# Altium schematic sheet Sensor Interface.SchDoc
size A4; SheetNumber: 3; SheetTotal: 4
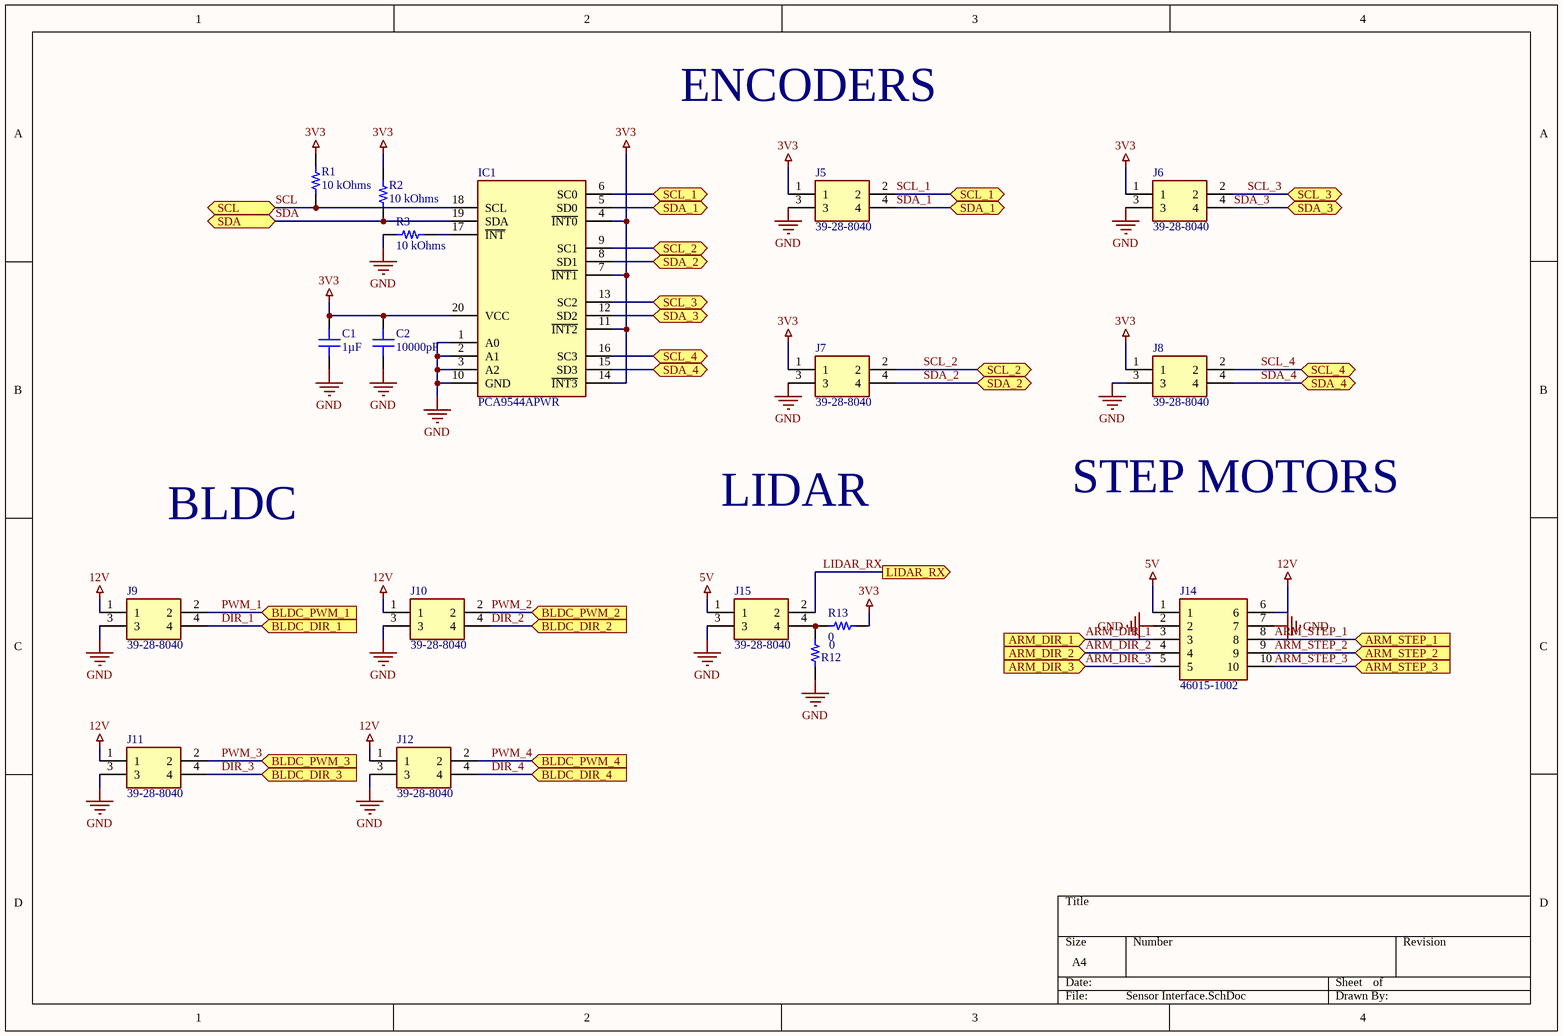
[diagram p0: Sensor Interface.SchDoc]

## Parts
C1  1µF  [CAP 0603_1608]
C2  10000pF  [CAP 0603_1608]
IC1  PCA9544APWR  [SOP65P640X120-20N]
J5  39-28-8040  [RHDR4W125P550X420_2X2_960X960X1310P]
J6  39-28-8040  [RHDR4W125P550X420_2X2_960X960X1310P]
J7  39-28-8040  [RHDR4W125P550X420_2X2_960X960X1310P]
J8  39-28-8040  [RHDR4W125P550X420_2X2_960X960X1310P]
J9  39-28-8040  [RHDR4W125P550X420_2X2_960X960X1310P]
J10  39-28-8040  [RHDR4W125P550X420_2X2_960X960X1310P]
J11  39-28-8040  [RHDR4W125P550X420_2X2_960X960X1310P]
J12  39-28-8040  [RHDR4W125P550X420_2X2_960X960X1310P]
J14  46015-1002  [460151002]
J15  39-28-8040  [RHDR4W125P550X420_2X2_960X960X1310P]
R1  10 kOhms  [RES 0603_1608]
R2  10 kOhms  [RES 0603_1608]
R3  10 kOhms  [RES 0603_1608]
R12  0  [RES 0603_1608]
R13  0  [RES 0603_1608]

## Ports
ARM_DIR_1 (in), ARM_DIR_2 (in), ARM_DIR_3 (in), ARM_STEP_1 (in), ARM_STEP_2 (in), ARM_STEP_3 (in), BLDC_DIR_1 (in), BLDC_DIR_2 (in), BLDC_DIR_3 (in), BLDC_DIR_4 (in), BLDC_PWM_1 (in), BLDC_PWM_2 (in), BLDC_PWM_3 (in), BLDC_PWM_4 (in), LIDAR_RX (out), SCL (bidir), SCL_1 (bidir), SCL_2 (bidir), SCL_3 (bidir), SCL_4 (bidir), SDA (bidir), SDA_1 (bidir), SDA_2 (bidir), SDA_3 (bidir), SDA_4 (bidir)

## Nets
3V3: C1.2 C2.2 IC1.4(~{INT0}) IC1.7(~{INT1}) IC1.11(~{INT2}) IC1.14(~{INT3}) IC1.20(VCC) J5.1 J6.1 J7.1 J8.1 R1.2 R2.2 R13.2
5V: J14.1 J15.1
12V: J9.1 J10.1 J11.1 J12.1 J14.6
GND: C1.1 C2.1 IC1.1(A0) IC1.2(A1) IC1.3(A2) IC1.10(GND) J5.3 J6.3 J7.3 J8.3 J9.3 J10.3 J11.3 J12.3 J14.2 J14.7 J15.3 R3.1 R12.1
ARM_DIR_1: J14.3 ; port ARM_DIR_1
ARM_DIR_2: J14.4 ; port ARM_DIR_2
ARM_DIR_3: J14.5 ; port ARM_DIR_3
ARM_STEP_1: J14.8 ; port ARM_STEP_1
ARM_STEP_2: J14.9 ; port ARM_STEP_2
ARM_STEP_3: J14.10 ; port ARM_STEP_3
DIR_1: J9.4 ; port BLDC_DIR_1
DIR_2: J10.4 ; port BLDC_DIR_2
DIR_3: J11.4 ; port BLDC_DIR_3
DIR_4: J12.4 ; port BLDC_DIR_4
LIDAR_RX: J15.2 ; port LIDAR_RX
PWM_1: J9.2 ; port BLDC_PWM_1
PWM_2: J10.2 ; port BLDC_PWM_2
PWM_3: J11.2 ; port BLDC_PWM_3
PWM_4: J12.2 ; port BLDC_PWM_4
SCL: IC1.18(SCL) R1.1 ; port SCL
SCL_1: IC1.6(SC0) J5.2 ; port SCL_1
SCL_2: IC1.9(SC1) J7.2 ; port SCL_2
SCL_3: IC1.13(SC2) J6.2 ; port SCL_3
SCL_4: IC1.16(SC3) J8.2 ; port SCL_4
SDA: IC1.19(SDA) R2.1 ; port SDA
SDA_1: IC1.5(SD0) J5.4 ; port SDA_1
SDA_2: IC1.8(SD1) J7.4 ; port SDA_2
SDA_3: IC1.12(SD2) J6.4 ; port SDA_3
SDA_4: IC1.15(SD3) J8.4 ; port SDA_4
NetIC1_17: IC1.17(~{INT}) R3.2
NetJ15_4: J15.4 R12.2 R13.1

## Notes on the sheet
- ENCODERS
- LIDAR
- STEP MOTORS
- BLDC

## Library data of the parts
C1 = C0603C105K4RACAUTO: CAP CER 0603 1UF 16V X7R 10%; Manufacturer: KEMET; Part Number: C0603C105K4RACAUTO; Value: 1µF; Applications: Automotive, Bypass, Decoupling; Capacitance: 1µF; ComponentLink1Description: Datasheet; ComponentLink1URL: https://api.kemet.com/component-edge/download/datasheet/C0603C105K4RACAUTO.pdf; ComponentLink2Description: DigiKey Link; ComponentLink2URL: http://digikey.com/product-detail/en/kemet/C0603C105K4RACAUTO/399-17704-1-ND/8635855; Device Package: 0603 (1608 Metric); LastUpdated: 2020-09-02 1:03:36 AM; Lifecycle Status: Active; Minimum Order: 1; Mounting Type: Surface Mount, MLCC; Operating Temperature: -55°C ~ 125°C; Package / Case: 0603 (1608 Metric); Packaging: TapeAndReel; PartId: 2179; Part Status: Active; Price: 0.02; Ratings: AEC-Q200; Series: SMD Auto X7R; Size / Dimension: 0.063" L x 0.031" W (1.60mm x 0.80mm); Supplier 1: DigiKey; Supplier Part Number 1: 399-17704-1-ND; Temperature Coefficient: X7R; Thickness (Max): 0.037" (0.95mm); Tolerance: ±10%; Voltage - Rated: 16V
C2 = C0603C103M4RACAUTO: CAP CER 0603 .01UF 16V X7R 20% A; Manufacturer: KEMET; Part Number: C0603C103M4RACAUTO; Value: 10000pF; Applications: Automotive, Bypass, Decoupling; Capacitance: 10000pF; ComponentLink1Description: Datasheet; ComponentLink1URL: https://api.kemet.com/component-edge/download/datasheet/C0603C103M4RACAUTO.pdf; ComponentLink2Description: DigiKey Link; ComponentLink2URL: http://digikey.com/product-detail/en/kemet/C0603C103M4RACAUTO/399-13714-1-ND/6219642; Device Package: 0603 (1608 Metric); LastUpdated: 2020-09-02 1:03:33 AM; Lifecycle Status: Active; Minimum Order: 1; Mounting Type: Surface Mount, MLCC; Operating Temperature: -55°C ~ 125°C; Package / Case: 0603 (1608 Metric); Packaging: TapeAndReel; PartId: 3731; Part Status: Active; Price: 0.02; Ratings: AEC-Q200; Series: SMD Auto X7R; Size / Dimension: 0.063" L x 0.031" W (1.60mm x 0.80mm); Supplier 1: DigiKey; Supplier Part Number 1: 399-13714-1-ND; Temperature Coefficient: X7R; Thickness (Max): 0.034" (0.87mm); Tolerance: ±20%; Voltage - Rated: 16V
IC1 = PCA9544APWR: Integrated Circuit; Manufacturer_Name: Texas Instruments; Datasheet Link: http://www.ti.com/lit/gpn/pca9544a; Height: 1.2mm; Manufacturer_Part_Number: PCA9544APWR; Mouser Part Number: 595-PCA9544APWR; Mouser Price/Stock: https://www.mouser.co.uk/ProductDetail/Texas-Instruments/PCA9544APWR?qs=wgAEGBTxy7mScfqW4P%2FhLg%3D%3D; Arrow Part Number: PCA9544APWR; Arrow Price/Stock: https://www.arrow.com/en/products/pca9544apwr/texas-instruments
J5-J12 J15 = 39-28-8040: Connector; Manufacturer_Name: Molex; Datasheet Link: https://www.molex.com/webdocs/datasheets/pdf/en-us/0039288040_PCB_HEADERS.pdf; Height: 13.1mm; Manufacturer_Part_Number: 39-28-8040; Mouser Part Number: 538-39-28-8040; Mouser Price/Stock: https://www.mouser.co.uk/ProductDetail/Molex/39-28-8040?qs=SeTnVz%252B%252BFGDDzw7HSzN2Lw%3D%3D; Arrow Part Number: 39-28-8040; Arrow Price/Stock: https://www.arrow.com/en/products/39-28-8040/molex
J14 = 46015-1002: Connector; Manufacturer_Name: Molex; Datasheet Link: https://www.molex.com/pdm_docs/sd/460151002_sd.pdf; Height: 13.3mm; Manufacturer_Part_Number: 46015-1002; Mouser Part Number: 538-46015-1002; Mouser Price/Stock: https://www.mouser.co.uk/ProductDetail/Molex/46015-1002?qs=vuaaJtqKbMZiZUhECIrnag%3D%3D
R1-R3 = AF0603FR-0710KL: RES SMD 10K OHM 1% 1/10W 0603; Manufacturer: Yageo; Power (Watts): 0.1W, 1/10W; Temperature Coefficient: ±100ppm/°C; Part Number: AF0603FR-0710KL; Value: 10 kOhms; ComponentLink1Description: Datasheet; ComponentLink1URL: http://www.yageo.com/documents/recent/PYu-AF_51_RoHS_L_6.pdf; ComponentLink2Description: DigiKey Link; ComponentLink2URL: http://digikey.com/product-detail/en/yageo/AF0603FR-0710KL/311-10KLMCT-ND/2828170; Composition: Thick Film; Device Package: 0603 (1608 Metric); Features: Anti-Sulfur, Moisture Resistant; Height - Seated (Max): 0.022" (0.55mm); LastUpdated: 2020-09-02 1:10:01 AM; Lifecycle Status: Active; Minimum Order: 1; Number of Terminations: 2; Operating Temperature: -55°C ~ 155°C; Package / Case: 0603 (1608 Metric); Packaging: TapeAndReel; PartId: 16021; Part Status: Active; Price: 0.01; Resistance: 10 kOhms; Series: AF; Size / Dimension: 0.063" L x 0.031" W (1.60mm x 0.80mm); Supplier 1: DigiKey; Supplier Part Number 1: 311-10KLMCT-ND; Supplier Device Package: 0603; Tolerance: ±1%
R12 R13 = TLRZ1JTTD: RES 0 OHM JUMPER 0603; Manufacturer: KOA Speer Electronics, Inc.; Part Number: TLRZ1JTTD; ComponentLink1Description: Datasheet; ComponentLink1URL: http://www.koaspeer.com/catimages/Products/TLRZ/TLRZ.pdf; ComponentLink2Description: DigiKey Link; ComponentLink2URL: http://digikey.com/product-detail/en/koa-speer-electronics-inc/TLRZ1JTTD/2019-TLRZ1JTTDCT-ND/9847537; Composition: Metal Element; Device Package: 0603 (1608 Metric); Features: Automotive AEC-Q200, Current Sense; Height - Seated (Max): 0.022" (0.55mm); LastUpdated: 2020-09-02 1:10:25 AM; Lifecycle Status: Active; Minimum Order: 1; Number of Terminations: 2; Operating Temperature: -55°C ~ 170°C; Package / Case: 0603 (1608 Metric); Packaging: TapeAndReel; PartId: 4851; Part Status: Active; Price: 0.08; Ratings: AEC-Q200; Series: TLRZ; Size / Dimension: 0.063" L x 0.031" W (1.60mm x 0.80mm); Supplier 1: DigiKey; Supplier Part Number 1: 2019-TLRZ1JTTDCT-ND; Supplier Device Package: 0603; Tolerance: Jumper